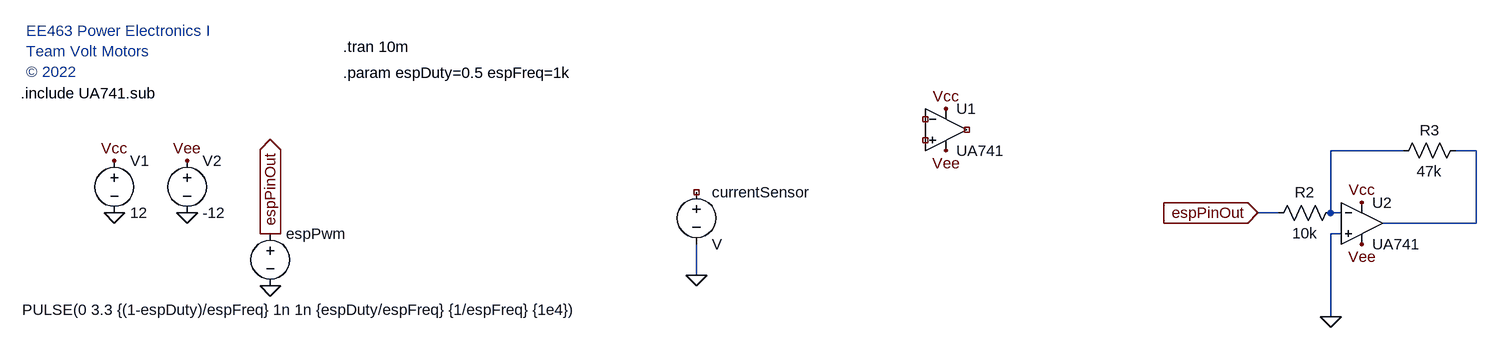
[diagram p0: schematic gateDriver.asc]
gateDriver.asc, the LTspice schematic file:
Version 4
SHEET 1 880 968
WIRE -928 -144 -1040 -144
WIRE -816 -144 -848 -144
WIRE -1120 -48 -1152 -48
WIRE -1040 -48 -1040 -144
WIRE -1024 -48 -1040 -48
WIRE -816 -32 -816 -144
WIRE -816 -32 -960 -32
WIRE -1024 -16 -1040 -16
WIRE -2016 48 -2016 0
WIRE -1040 112 -1040 -16
FLAG -2912 -48 0
FLAG -2912 -128 Vcc
FLAG -2800 -48 0
FLAG -2800 -128 Vee
FLAG -2672 64 0
FLAG -2672 -16 espPinOut
IOPIN -2672 -16 Out
FLAG -1040 112 0
FLAG -1152 -48 espPinOut
IOPIN -1152 -48 In
FLAG -992 0 Vee
FLAG -992 -64 Vcc
FLAG -1632 -144 Vee
FLAG -1632 -208 Vcc
FLAG -2016 48 0
SYMBOL voltage -2912 -144 R0
WINDOW 123 0 0 Left 0
WINDOW 39 0 0 Left 0
SYMATTR InstName V1
SYMATTR Value 12
SYMBOL voltage -2800 -144 R0
WINDOW 123 0 0 Left 0
WINDOW 39 0 0 Left 0
SYMATTR InstName V2
SYMATTR Value -12
SYMBOL voltage -2672 -32 R0
WINDOW 3 -382 133 Left 2
WINDOW 123 0 0 Left 0
WINDOW 39 0 0 Left 0
SYMATTR InstName espPwm
SYMATTR Value PULSE(0 3.3 {(1-espDuty)/espFreq} 1n 1n {espDuty/espFreq} {1/espFreq} {1e4})
SYMBOL OpAmps\\opamp2 -992 -96 R0
SYMATTR InstName U2
SYMATTR Value UA741
SYMBOL res -1024 -64 R90
WINDOW 0 0 56 VBottom 2
WINDOW 3 32 56 VTop 2
SYMATTR InstName R2
SYMATTR Value 10k
SYMBOL res -832 -160 R90
WINDOW 0 0 56 VBottom 2
WINDOW 3 32 56 VTop 2
SYMATTR InstName R3
SYMATTR Value 47k
SYMBOL voltage -2016 -96 R0
SYMATTR InstName currentSensor
SYMBOL OpAmps\\opamp2 -1632 -240 R0
SYMATTR InstName U1
SYMATTR Value UA741
TEXT -3048 -328 Left 2 ;EE463 Power Electronics I\nTeam Volt Motors\n© 2022
TEXT -2560 -264 Left 2 !.param espDuty=0.5 espFreq=1k
TEXT -2560 -304 Left 2 !.tran 10m
TEXT -3056 -232 Left 2 !.include UA741.sub

The netlist it stands for:
* gateDriver.asc
V1 Vcc 0 12
V2 Vee 0 -12
V§espPwm espPinOut 0 PULSE(0 3.3 {(1-espDuty)/espFreq} 1n 1n {espDuty/espFreq} {1/espFreq} {1e4})
XU2 0 N001 Vcc Vee N002 UA741  ; pins In+ In- V+ V- OUT
R2 N001 espPinOut 10k
R3 N002 N001 47k
V§currentSensor NC_01 0 V
XU1 NC_02 NC_03 Vcc Vee NC_04 UA741  ; pins In+ In- V+ V- OUT
* EE463 Power Electronics I
* Team Volt Motors
* © 2022
.param espDuty=0.5 espFreq=1k
.tran 10m
.include UA741.sub
.backanno
.end